# Altium schematic sheet CAN_Transceiver.SchDoc
size A3; SheetNumber: 1; SheetTotal: 1
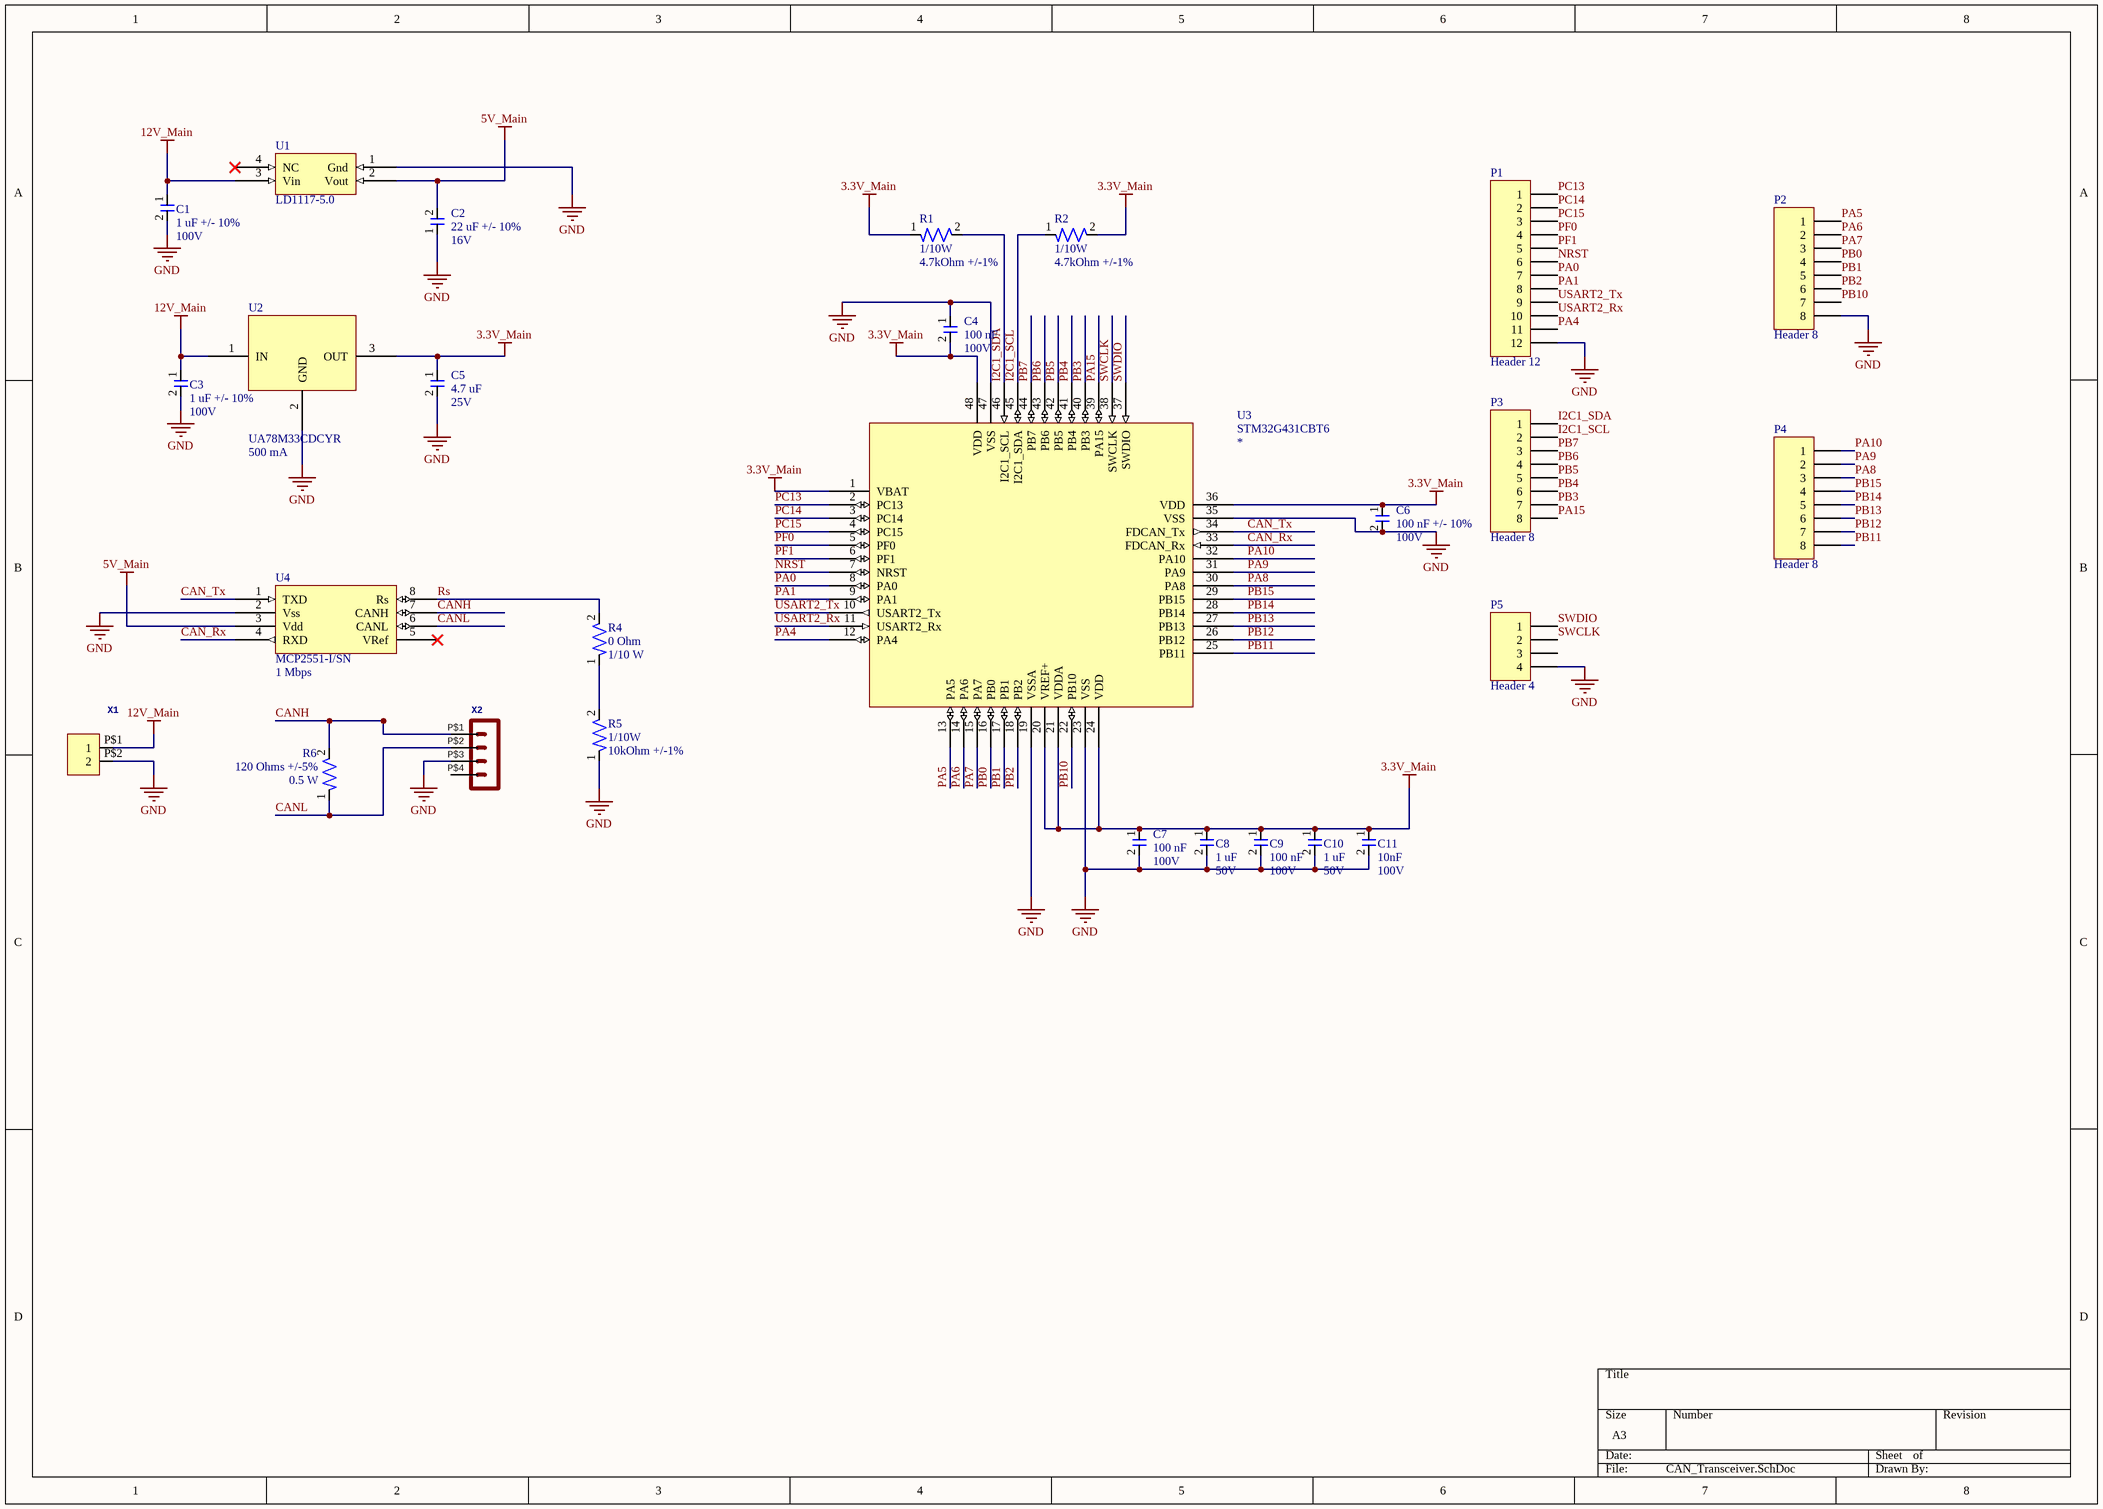
[diagram p0: CAN_Transceiver.SchDoc]

## Parts
C1  Capacitance: 1 uF +/- 10%  Voltage: 100V  [CAP-1206 - duplicate]  (hidden comment: CL31B105KCHNNNE)
C2  22 uF +/- 10%  [CAP-1206]
C3  Capacitance: 1 uF +/- 10%  Voltage: 100V  [CAP-1206 - duplicate]  (hidden comment: CL31B105KCHNNNE)
C4  Capacitance: 100 nF  Voltage: 100V  [CAP-0603]  (hidden comment: CC0603KRX7R0BB104)
C5  Capacitacen: 4.7 uF  Voltage: 25V  [CAP-0603]  (hidden comment: CC0603KRX5R8BB475)
C6  Capacitance: 100 nF +/- 10%  Voltage: 100V  [CAP-0603]  (hidden comment: CC0603KRX7R0BB104)
C7  Capacitance: 100 nF  Voltage: 100V  [CAP-0603]  (hidden comment: CC0603KRX7R0BB104)
C8  Capacitance: 1 uF  Voltage: 50V  [CAP-0603]  (hidden comment: UMK107AB7105KA-T)
C9  Capacitance: 100 nF  Voltage: 100V  [CAP-0603]  (hidden comment: CC0603KRX7R0BB104)
C10  Capacitance: 1 uF  Voltage: 50V  [CAP-0603]  (hidden comment: UMK107AB7105KA-T)
C11  Capacitance: 10nF  Voltage Rating: 100V  [CAP-0603]  (hidden comment: C1608C0G2A103J080AC)
P1  Header 12  [HDR1X12]
P2  Header 8  [HDR1X8]
P3  Header 8  [HDR1X8]
P4  Header 8  [HDR1X8]
P5  Header 4  [HDR1X4]
R1  Power Rating: 1/10W  Resistance: 4.7kOhm +/-1%  [RES-0603]  (hidden comment: AF0603FR-074K7L)
R2  Power Rating: 1/10W  Resistance: 4.7kOhm +/-1%  [RES-0603]  (hidden comment: AF0603FR-074K7L)
R4  Resistance: 0 Ohm  Power: 1/10 W  [RES-0603]  (hidden comment: RMCF0603ZT0R00)
R5  Power Rating: 1/10W  Resistance: 10kOhm +/-1%  [RES-0603]  (hidden comment: RC0603FR-0710KP)
R6  Resistance: 120 Ohms +/-5%  Power: 0.5 W  [RES-0805]  (hidden comment: ERJ-P06J121V)
U1  LD1117-5.0  [SOT-223-3L]
U2  UA78M33CDCYR  Current: 500 mA  [SOT-223-4]
U3  STM32G431CBT6  [Quad48]
U4  MCP2551-I/SN  Bitrate: 1 Mbps  [IC-BUCK-8SOIC]
X1  Molex 43650-0200  [43650-0200]  (value not drawn)
X2  Molex - Micro-Fit 3.0 Series connector,  3.00mm (0.118") pitch header, 4 positions.  [43650-0400]  (value not drawn)

## Nets
3.3V_Main: C4.2 C5.1 C6.1 C7.1 C8.1 C9.1 C10.1 C11.1 R1.1 R2.2 U2.3(OUT) U3.1(VBAT) U3.20(VREF+) U3.21(VDDA) U3.24(VDD) U3.36(VDD) U3.48(VDD)
5V_Main: C2.2 U1.2(Vout) U4.3(Vdd)
12V_Main: C1.1 C3.1 U1.3(Vin) U2.1(IN) X1.P$1(1)
GND: C1.2 C2.1 C3.2 C4.1 C5.2 C6.2 C7.2 C8.2 C9.2 C10.2 C11.2 P1.12 P2.8 P5.4 R5.1 U1.1(Gnd) U2.2(GND) U3.19(VSSA) U3.23(VSS) U3.35(VSS) U3.47(VSS) U4.2(Vss) X1.P$2(2) X2.P$3
CAN_Rx: U3.33(FDCAN_Rx) U4.4(RXD)
CAN_Tx: U3.34(FDCAN_Tx) U4.1(TXD)
CANH: R6.2 U4.7(CANH) X2.P$1
CANL: R6.1 U4.6(CANL) X2.P$2
I2C1_SCL: P3.2 R2.1 U3.45(I2C1_SDA)
I2C1_SDA: P3.1 R1.2 U3.46(I2C1_SCL)
NRST: P1.6 U3.7(NRST)
PA0: P1.7 U3.8(PA0)
PA1: P1.8 U3.9(PA1)
PA4: P1.11 U3.12(PA4)
PA5: P2.1 U3.13(PA5)
PA6: P2.2 U3.14(PA6)
PA7: P2.3 U3.15(PA7)
PA8: P4.3 U3.30(PA8)
PA9: P4.2 U3.31(PA9)
PA10: P4.1 U3.32(PA10)
PA15: P3.8 U3.39(PA15)
PB0: P2.4 U3.16(PB0)
PB1: P2.5 U3.17(PB1)
PB2: P2.6 U3.18(PB2)
PB3: P3.7 U3.40(PB3)
PB4: P3.6 U3.41(PB4)
PB5: P3.5 U3.42(PB5)
PB6: P3.4 U3.43(PB6)
PB7: P3.3 U3.44(PB7)
PB10: P2.7 U3.22(PB10)
PB11: P4.8 U3.25(PB11)
PB12: P4.7 U3.26(PB12)
PB13: P4.6 U3.27(PB13)
PB14: P4.5 U3.28(PB14)
PB15: P4.4 U3.29(PB15)
PC13: P1.1 U3.2(PC13)
PC14: P1.2 U3.3(PC14)
PC15: P1.3 U3.4(PC15)
PF0: P1.4 U3.5(PF0)
PF1: P1.5 U3.6(PF1)
Rs: R4.2 U4.8(Rs)
SWCLK: P5.2 U3.38(SWCLK)
SWDIO: P5.1 U3.37(SWDIO)
USART2_Rx: P1.10 U3.11(USART2_Rx)
USART2_Tx: P1.9 U3.10(USART2_Tx)
NetR4_1: R4.1 R5.2

Not connected (* = marked no-connect by the designer): P5 3; U1 4(NC)*; U4 5(VRef)*; X2 P$4(4)

## Notes on the sheet
- (near C2) 16V

## Library data of the parts
C1 C3 = CAP-1U-0001: 1 µF ±10% 100V Ceramic Capacitor X7R 1206 (3216 Metric)
C2 = CAP-22U-0002: 22 µF Molded Tantalum Capacitors 16 V 1206 (3216 Metric)
C4 C6 C7 C9 = CAP-100N-0002-JLC: 100V 100nF X7R ±10% 0603 Multilayer Ceramic Capacitors MLCC - SMD/SMT ROHS; assembled?: yes; JLC Part Number: C113803
C5 = CAP-4.7U-0002-JLC: 25V 4.7uF X5R ±10% 0603 Multilayer Ceramic Capacitors MLCC - SMD/SMT ROHS; assembled: yes; JLC part number: C326580
C8 C10 = CAP-1U-0002: 1 µF ±10% 50V Ceramic Capacitor X7R 0603 (1608 Metric); Package Size: 0603
C11 = CAP-10N-0002: CAP CER 10000PF 100V C0G 0603; Manufacturer: TDK Corporation; Temperature Coefficient: C0G/NP0; Assembled?: no; Manufacturer Part Number: C1608C0G2A103J080AC; Package Size: 0603
P1 = Header 12: Header, 12-Pin; LatestRevisionDate: 17-Jul-2002; LatestRevisionNote: Re-released for DXP Platform.; Publisher: Altium Limited
P2-P4 = Header 8: Header, 8-Pin; LatestRevisionDate: 17-Jul-2002; LatestRevisionNote: Re-released for DXP Platform.; Publisher: Altium Limited
P5 = Header 4: Header, 4-Pin; LatestRevisionDate: 17-Jul-2002; LatestRevisionNote: Re-released for DXP Platform.; Publisher: Altium Limited
R1 R2 = RES-4.7K-0002: RES SMD 4.7K OHM 1% 1/10W 0603; Manufacturer: YAGEO; Assembled?: no; Manufacturer Part Number: AF0603FR-074K7L; Package Size: 0603
R4 = RES-0-0001: 0 Ohms Jumper 0.1W, 1/10W Chip Resistor 0603 (1608 Metric) Automotive AEC-Q200 Thick Film; Package Size: 0603
R5 = RES-10K-0002: RES SMD 10K OHM 1% 1/10W 0603; Manufacturer: YAGEO; Assembled?: no; Manufacturer Part Number: RC0603FR-0710KP; Package Size: 0603
R6 = RES-120-0001: 120 Ohms ±5% 0.5W, 1/2W Chip Resistor 0805 (2012 Metric) Automotive AEC-Q200, Pulse Withstanding Thick Film
U1 = LDO-5V-0002: 1A 60dB@(120Hz) Fixed 5V~5V Positive 18V SOT-223  Linear Voltage Regulators (LDO) ROHS; Vout: 5V; Vin: 12V; Current: 1A
U2 = LDO-3.3V-0002: Linear Voltage Regulator IC Positive Fixed 1 Output 500mA SOT-223-4; Vin: 25V; Vout: 3.3V; Package: SOT-223-4
U3 = IC-STM32G431CBT6-0001: ARM® Cortex®-M4F STM32G4 Microcontroller IC 32-Bit Single-Core 170MHz 128KB (128K x 8) FLASH 48-LQFP (7x7); Parameter 1: *
U4 = IC-CAN-TRANSCEIVER-0001: 1/1 Transceiver Half CANbus 8-SOIC
X1 = Micro-Fit Molex 2 Pin Right Angle: GateName_1: G$1; SymbolName_1: HEADER_POS2; DeviceSetName: HEADER_POS2_?; DeviceName: 43650-0200; LibraryName: con-molex-micro-fit-3_0_2; Package: 43650-0200
X2 = HEADER_POS4_?43650-0400: GateName_1: G$1; DeviceName: 43650-0409; SymbolName_1: HEADER_POS4; LibraryName: con-molex-micro-fit-3_0_2; DeviceSetName: HEADER_POS4_?; Package: 43650-0409